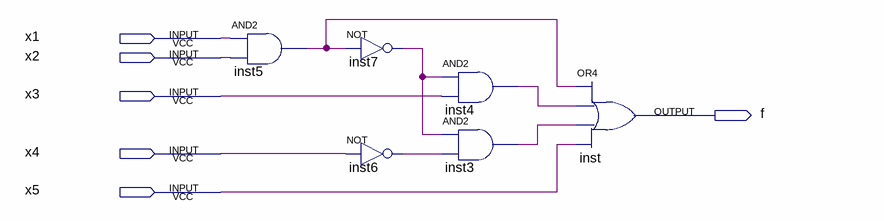
[diagram p0: schematic sheet]
// Quartus schematic hw9p2.bdf as structural Verilog: 6 symbols, 6 pins
module hw9p2 (
  input  x1,
  input  x2,
  input  x3,
  input  x4,
  input  x5,
  output f
);

  wire inst3_out, inst4_out, inst5_out, inst6_out, inst7_out;

  and inst5 (inst5_out, x1, x2);
  not inst7 (inst7_out, inst5_out);
  not inst6 (inst6_out, x4);
  and inst4 (inst4_out, inst7_out, x3);
  and inst3 (inst3_out, inst7_out, inst6_out);
  or inst (f, inst5_out, inst4_out, inst3_out, x5);
endmodule
